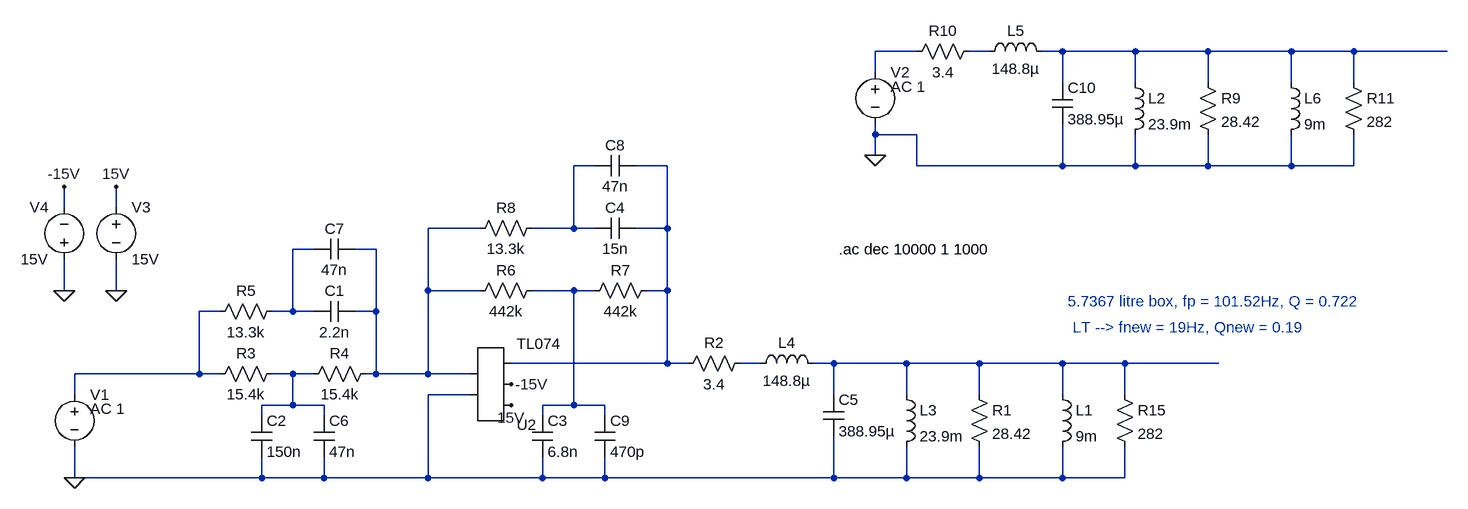
[diagram p0: schematic mounted_pyle.asc]
mounted_pyle.asc, the LTspice schematic file:
Version 4
SHEET 1 1108 1288
WIRE -160 288 -224 288
WIRE -48 288 -80 288
WIRE 64 288 32 288
WIRE 176 288 64 288
WIRE 288 288 176 288
WIRE 416 288 288 288
WIRE 512 288 416 288
WIRE 656 288 512 288
WIRE -224 320 -224 288
WIRE 64 336 64 288
WIRE 176 336 176 288
WIRE 288 336 288 288
WIRE 416 336 416 288
WIRE 512 336 512 288
WIRE -224 416 -224 400
WIRE -160 416 -224 416
WIRE -224 448 -224 416
WIRE -656 464 -688 464
WIRE -544 464 -592 464
WIRE -160 464 -160 416
WIRE 64 464 64 400
WIRE 64 464 -160 464
WIRE 176 464 176 416
WIRE 176 464 64 464
WIRE 288 464 288 416
WIRE 288 464 176 464
WIRE 416 464 416 416
WIRE 416 464 288 464
WIRE 512 464 512 416
WIRE 512 464 416 464
WIRE -1472 528 -1472 496
WIRE -1392 528 -1392 496
WIRE -832 560 -912 560
WIRE -688 560 -688 464
WIRE -688 560 -752 560
WIRE -656 560 -688 560
WIRE -544 560 -544 464
WIRE -544 560 -592 560
WIRE -1088 592 -1120 592
WIRE -992 592 -1024 592
WIRE -1472 656 -1472 608
WIRE -1392 656 -1392 608
WIRE -912 656 -912 560
WIRE -832 656 -912 656
WIRE -688 656 -752 656
WIRE -656 656 -688 656
WIRE -544 656 -544 560
WIRE -544 656 -576 656
WIRE -1232 688 -1264 688
WIRE -1120 688 -1120 592
WIRE -1120 688 -1152 688
WIRE -1088 688 -1120 688
WIRE -992 688 -992 592
WIRE -992 688 -1024 688
WIRE -544 768 -544 656
WIRE -544 768 -784 768
WIRE -512 768 -544 768
WIRE -400 768 -432 768
WIRE -288 768 -320 768
WIRE -176 768 -288 768
WIRE -64 768 -176 768
WIRE 64 768 -64 768
WIRE 160 768 64 768
WIRE 304 768 160 768
WIRE -1264 784 -1264 688
WIRE -1264 784 -1456 784
WIRE -1232 784 -1264 784
WIRE -1120 784 -1152 784
WIRE -1088 784 -1120 784
WIRE -992 784 -992 688
WIRE -992 784 -1008 784
WIRE -912 784 -912 656
WIRE -912 784 -992 784
WIRE -848 784 -912 784
WIRE -1456 816 -1456 784
WIRE -848 816 -912 816
WIRE -288 816 -288 768
WIRE -176 816 -176 768
WIRE -64 816 -64 768
WIRE 64 816 64 768
WIRE 160 816 160 768
WIRE -1120 832 -1120 784
WIRE -1120 832 -1168 832
WIRE -1072 832 -1120 832
WIRE -688 832 -688 656
WIRE -688 832 -736 832
WIRE -640 832 -688 832
WIRE -1168 848 -1168 832
WIRE -1072 848 -1072 832
WIRE -736 848 -736 832
WIRE -640 848 -640 832
WIRE -1456 944 -1456 896
WIRE -1168 944 -1168 912
WIRE -1168 944 -1456 944
WIRE -1072 944 -1072 912
WIRE -1072 944 -1168 944
WIRE -912 944 -912 816
WIRE -912 944 -1072 944
WIRE -736 944 -736 912
WIRE -736 944 -912 944
WIRE -640 944 -640 912
WIRE -640 944 -736 944
WIRE -288 944 -288 880
WIRE -288 944 -640 944
WIRE -176 944 -176 896
WIRE -176 944 -288 944
WIRE -64 944 -64 896
WIRE -64 944 -176 944
WIRE 64 944 64 896
WIRE 64 944 -64 944
WIRE 160 944 160 896
WIRE 160 944 64 944
FLAG -1456 944 0
FLAG -784 832 15V
FLAG -784 800 -15V
FLAG -224 448 0
FLAG -1392 496 15V
FLAG -1392 656 0
FLAG -1472 656 0
FLAG -1472 496 -15V
SYMBOL cap -304 816 R0
SYMATTR InstName C5
SYMATTR Value 388.95µ
SYMBOL ind -192 800 R0
SYMATTR InstName L3
SYMATTR Value 23.9m
SYMBOL res -80 800 R0
SYMATTR InstName R1
SYMATTR Value 28.42
SYMBOL res -416 752 R90
WINDOW 0 0 56 VBottom 2
WINDOW 3 32 56 VTop 2
SYMATTR InstName R2
SYMATTR Value 3.4
SYMBOL ind -416 784 R270
WINDOW 0 32 56 VTop 2
WINDOW 3 5 56 VBottom 2
SYMATTR InstName L4
SYMATTR Value 148.8µ
SYMBOL ind 48 800 R0
SYMATTR InstName L1
SYMATTR Value 9m
SYMBOL res 144 800 R0
SYMATTR InstName R15
SYMATTR Value 282
SYMBOL voltage -1456 800 R0
WINDOW 123 24 38 Left 2
WINDOW 39 0 0 Left 0
WINDOW 3 24 44 Left 2
SYMATTR Value2 AC 1
SYMATTR Value ""
SYMATTR InstName V1
SYMBOL res -1136 768 R90
WINDOW 0 0 56 VBottom 2
WINDOW 3 32 56 VTop 2
SYMATTR InstName R3
SYMATTR Value 15.4k
SYMBOL res -992 768 R90
WINDOW 0 0 56 VBottom 2
WINDOW 3 32 56 VTop 2
SYMATTR InstName R4
SYMATTR Value 15.4k
SYMBOL res -1136 672 R90
WINDOW 0 0 56 VBottom 2
WINDOW 3 32 56 VTop 2
SYMATTR InstName R5
SYMATTR Value 13.3k
SYMBOL cap -1024 672 R90
WINDOW 0 0 32 VBottom 2
WINDOW 3 32 32 VTop 2
SYMATTR InstName C1
SYMATTR Value 2.2n
SYMBOL cap -1184 848 R0
SYMATTR InstName C2
SYMATTR Value 150n
SYMBOL res -736 640 R90
WINDOW 0 0 56 VBottom 2
WINDOW 3 32 56 VTop 2
SYMATTR InstName R6
SYMATTR Value 442k
SYMBOL cap -752 848 R0
SYMATTR InstName C3
SYMATTR Value 6.8n
SYMBOL res -560 640 R90
WINDOW 0 0 56 VBottom 2
WINDOW 3 32 56 VTop 2
SYMATTR InstName R7
SYMATTR Value 442k
SYMBOL res -736 544 R90
WINDOW 0 0 56 VBottom 2
WINDOW 3 32 56 VTop 2
SYMATTR InstName R8
SYMATTR Value 13.3k
SYMBOL cap -592 544 R90
WINDOW 0 0 32 VBottom 2
WINDOW 3 32 32 VTop 2
SYMATTR InstName C4
SYMATTR Value 15n
SYMBOL cap -1088 848 R0
SYMATTR InstName C6
SYMATTR Value 47n
SYMBOL cap -1024 576 R90
WINDOW 0 0 32 VBottom 2
WINDOW 3 32 32 VTop 2
SYMATTR InstName C7
SYMATTR Value 47n
SYMBOL cap -592 448 R90
WINDOW 0 0 32 VBottom 2
WINDOW 3 32 32 VTop 2
SYMATTR InstName C8
SYMATTR Value 47n
SYMBOL cap -656 848 R0
SYMATTR InstName C9
SYMATTR Value 470p
SYMBOL cap 48 336 R0
SYMATTR InstName C10
SYMATTR Value 388.95µ
SYMBOL ind 160 320 R0
SYMATTR InstName L2
SYMATTR Value 23.9m
SYMBOL res 272 320 R0
SYMATTR InstName R9
SYMATTR Value 28.42
SYMBOL res -64 272 R90
WINDOW 0 0 56 VBottom 2
WINDOW 3 32 56 VTop 2
SYMATTR InstName R10
SYMATTR Value 3.4
SYMBOL ind -64 304 R270
WINDOW 0 32 56 VTop 2
WINDOW 3 5 56 VBottom 2
SYMATTR InstName L5
SYMATTR Value 148.8µ
SYMBOL ind 400 320 R0
SYMATTR InstName L6
SYMATTR Value 9m
SYMBOL res 496 320 R0
SYMATTR InstName R11
SYMATTR Value 282
SYMBOL voltage -224 304 R0
WINDOW 123 24 38 Left 2
WINDOW 39 0 0 Left 0
SYMATTR Value2 AC 1
SYMATTR InstName V2
SYMATTR Value ""
SYMBOL AutoGenerated\\TL074 -816 800 M180
SYMATTR InstName U2
SYMBOL voltage -1392 512 R0
SYMATTR InstName V3
SYMATTR Value 15V
SYMBOL voltage -1472 624 R180
WINDOW 0 24 96 Left 2
WINDOW 3 24 16 Left 2
SYMATTR InstName V4
SYMATTR Value 15V
TEXT -280 592 Left 2 !.ac dec 10000 1 1000
TEXT 72 672 Left 2 ;5.7367 litre box, fp = 101.52Hz, Q = 0.722
TEXT 80 712 Left 2 ;LT --> fnew = 19Hz, Qnew = 0.19

The netlist it stands for:
* mounted_pyle.asc
C5 N011 0 388.95µ
L3 N011 0 23.9m
R1 N011 0 28.42
R2 N010 N005 3.4
L4 N010 N011 148.8µ
L1 N011 0 9m
R15 N011 0 282
V1 N009 0 AC 1
R3 N012 N009 15.4k
R4 N006 N012 15.4k
R5 N007 N009 13.3k
C1 N006 N007 2.2n
C2 N012 0 150n
R6 N008 N006 442k
C3 N008 0 6.8n
R7 N005 N008 442k
R8 N004 N006 13.3k
C4 N005 N004 15n
C6 N012 0 47n
C7 N006 N007 47n
C8 N005 N004 47n
C9 N008 0 470p
C10 N003 0 388.95µ
L2 N003 0 23.9m
R9 N003 0 28.42
R10 N002 N001 3.4
L5 N002 N003 148.8µ
L6 N003 0 9m
R11 N003 0 282
V2 N001 0 AC 1
* U2: TL074 (symbol AutoGenerated\TL074 not available, pins judged from their places): pin1=0 pin2=N006 pin3=15V pin4=-15V pin5=N005
V3 15V 0 15V
V4 0 -15V 15V
.ac dec 10000 1 1000
* 5.7367 litre box, fp = 101.52Hz, Q = 0.722
* LT --> fnew = 19Hz, Qnew = 0.19
.backanno
.end